# Altium schematic sheet BLHP2432_H24-Fan-Controller.SchDoc
size A4; SheetNumber: 1; SheetTotal: 1
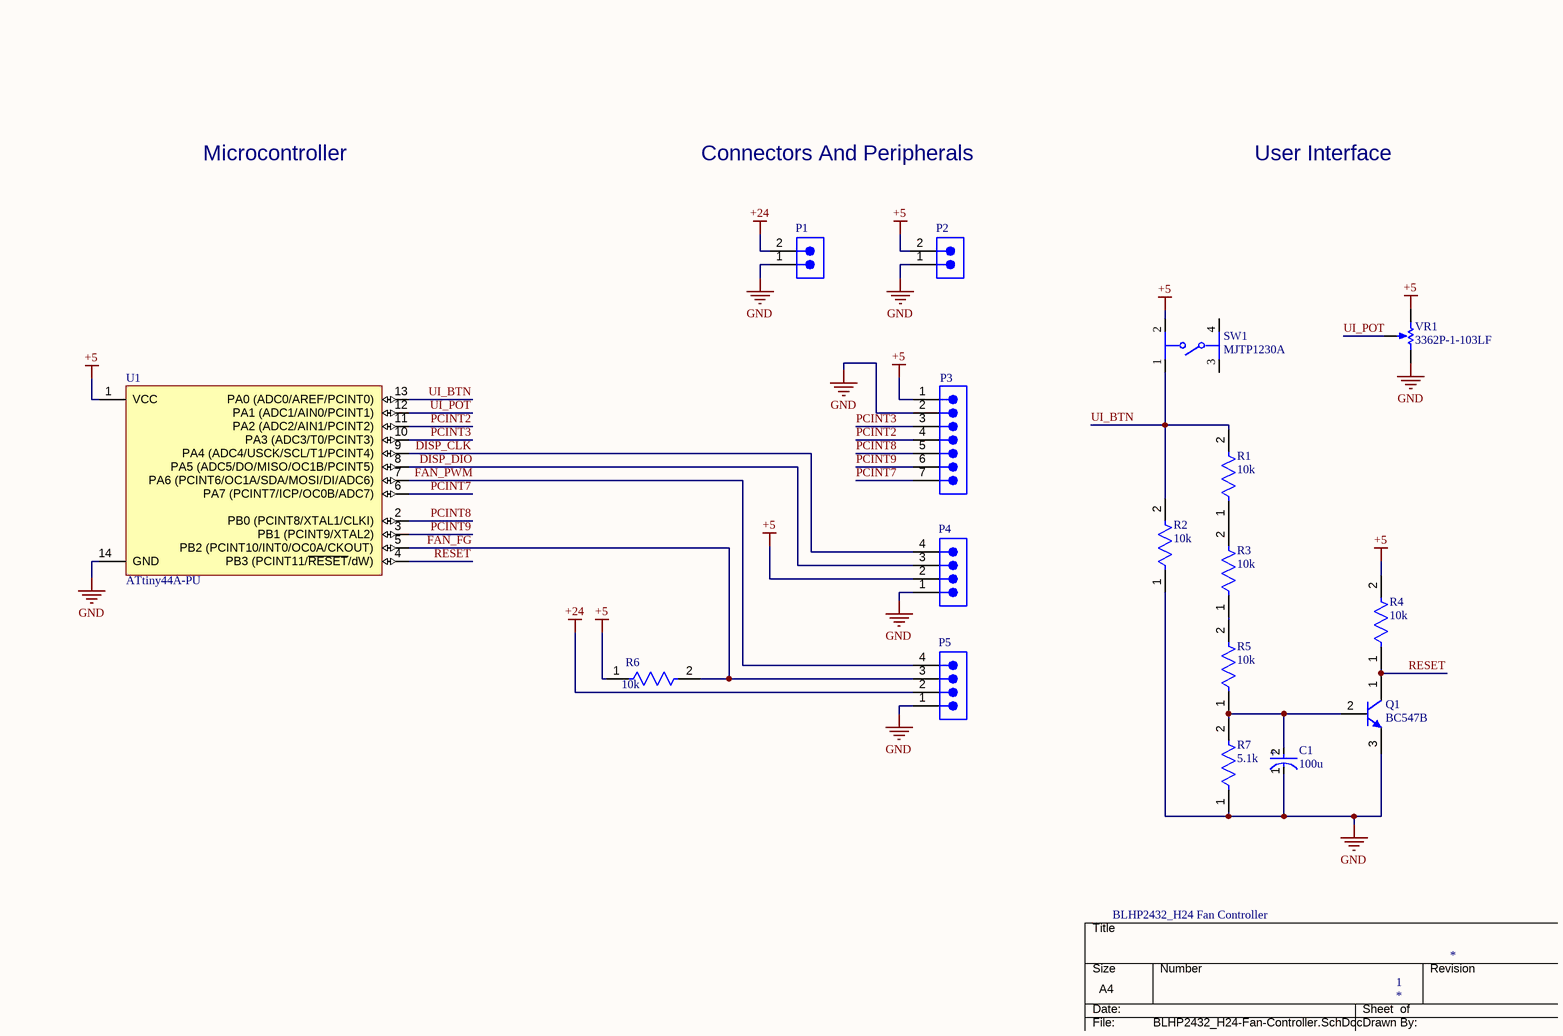
[diagram p0: BLHP2432_H24-Fan-Controller.SchDoc]

## Parts
C1  100u  [FP-UHW1E222MHD-MFG]
P1  TSW-102-26-G-S  [SMTC-TSW-102-26-XX-S]  (value not drawn)
P2  TSW-102-26-G-S  [SMTC-TSW-102-26-XX-S]  (value not drawn)
P3  61300711021  [61300711021]  (value not drawn)
P4  (no value)  [SMTC-TSW-104-08-X-S]
P5  (no value)  [SMTC-TSW-104-08-X-S]
Q1  BC547B  [ONSC-TO-92-3-29-11]
R1  10k  [FP-MBB0207-MFG]
R2  10k  [FP-MBB0207-MFG]
R3  10k  [FP-MBB0207-MFG]
R4  10k  [FP-MBB0207-MFG]
R5  10k  [FP-MBB0207-MFG]
R6  10k  [FP-MBB0207-MFG]
R7  5.1k  [FP-MBB0207-MFG]
SW1  MJTP1230A  [FP-MJTP1230A-MFG]
U1  ATtiny44A-PU  [14P3]
VR1  3362P-1-103LF  [BOUR-3362P]

## Nets
+5: P2.2 P3.1 P4.2 R4.2 R6.1 SW1.2 U1.1(VCC) VR1.1(CCW)
+24: P1.2 P5.2
GND: C1.1(C) P1.1 P2.1 P3.2 P4.1 P5.1 Q1.3(E) R2.1 R7.1 U1.14(GND) VR1.3(CW)
DISP_CLK: P4.4 U1.9(PA4_(ADC4/USCK/SCL/T1/PCINT4))
DISP_DIO: P4.3 U1.8(PA5_(ADC5/DO/MISO/OC1B/PCINT5))
FAN_FG: P5.3 R6.2 U1.5(PB2_(PCINT10/INT0/OC0A/CKOUT))
FAN_PWM: P5.4 U1.7(PA6_(PCINT6/OC1A/SDA/MOSI/DI/ADC6))
PCINT2: P3.4 U1.11(PA2_(ADC2/AIN1/PCINT2))
PCINT3: P3.3 U1.10(PA3_(ADC3/T0/PCINT3))
PCINT7: P3.7 U1.6(PA7_(PCINT7/ICP/OC0B/ADC7))
PCINT8: P3.5 U1.2(PB0_(PCINT8/XTAL1/CLKI))
PCINT9: P3.6 U1.3(PB1_(PCINT9/XTAL2))
RESET: Q1.1(C) R4.1 U1.4(PB3_(PCINT11/~{RESET}/dW))
UI_BTN: R1.2 R2.2 SW1.1 U1.13(PA0_(ADC0/AREF/PCINT0))
UI_POT: U1.12(PA1_(ADC1/AIN0/PCINT1)) VR1.2(S)
NetC1_2: C1.2(A) Q1.2(B) R5.1 R7.2
NetR1_1: R1.1 R3.2
NetR3_1: R3.1 R5.2

Not connected (* = marked no-connect by the designer): SW1 3 4

## Notes on the sheet
- Microcontroller
- Connectors And Peripherals
- User Interface
- BLHP2432_H24 Fan Controller
- DWG. NO.
- REV.
- SHT.
- THIS DOCUMENT AND THE DATA DISCLOSED HEREIN OR HEREWITH IS THE PROPERTY OF ALTIUM LIMITED AND MAY BE FREELY DISTRIBUTED IN WHOLE. NO RIGHTS ARE RESERVED OR EXPRESS OR IMPLIED WARANTEE GIVEN.
- REVISION
- DESCRIPTION
- DATE
- APPROVED
- ENG:
- APPROVALS
- PROJECT
- DSN:
- CHK:
- REFERENCE DOCUMENTS
- PROJECT REVISION:
- TITLE
- DOCUMENT REVISION:
- DESIGN ITEM:
- BOM:
- FAB DWG:
- PCB DWG:
- ASSY DWG:
- SCALE:
- SIZE
- B
- CAGE CODE
- FILE NAME
- DWG NO.
- SHEET
- OF
- REV
- (in symbol CMP-12462-000038-1) +

## Library data of the parts
C1 = CMP-12462-000038-1: CAP ALUM 2200UF 20% 25V RADIAL; Capacitance: 2.2mF; Ripple Current: 3.2A; Impedance: 15mR; Life (Hours): 10000Hour; Tolerance: 20%; Packaging: Bulk; Case/Package: Radial; Min Operating Temperature: -40°C; Height - Seated (Max): 1.063inch; Max Operating Temperature: 105°C; Series: HW; Lead Pitch: 0.197inch; RoHS Compliant: Yes; Voltage Rating: 25V; Package Quantity: 100; Mount: Through Hole
P1 P2 = CMP-1024-00327-1: 0.025" SQ Post Header, Through-hole, Vertical, -55 to 125 degC, 2.54 mm Pitch, 2-Pin, Male, RoHS; Manufacturer: Samtec; Pitch: 2.54 mm; Orientation: Vertical; ComponentLink3Description: Package Specification; PackageReference: TSW-102-26-XX-S; Mounting Technology: Through-hole; ComponentLink2Description: Datasheet; ComponentLink1URL: http://www.samtec.com; DatasheetVersion: F-214; ComponentLink1Description: Manufacturer URL; RoHS: True; ComponentLink2URL: http://www.samtec.com/documents/webfiles/pdf/TSW_TH.PDF; PartNumber: TSW-102-26-G-S; ComponentLink3URL: http://www.samtec.com/documents/webfiles/cpdf/TSW-XXX-XX-XXX-X-XX-XXX-MKT.pdf; PackageDescription: .025[0.64] SQ. Post Terminal Strip Assembly; PackageVersion: DM, 8/1988; Temperature Range: -55 to 125 degC
P3 = CMP-1502-01073-5: THT Angled Pin Header WR-PHD, Pitch 2.54 mm, Single Row, 7 pins; Voltage Rating: 250V; Number of Positions: 7; Contact Resistance: 20mΩ; Connector Type: Male Pin; Gender: Male; Current Rating: 3A; Pitch: 2.54mm; Contact Mating Length: 5.9944mm; Packaging: Bulk; Termination: Solder; Lead Pitch: 2.54mm; Mount: Through Hole; Operating Supply Voltage: 250V; Min Operating Temperature: -40°C; Contact Material: Gold; Number of Rows: 1; RoHS: Compliant; Contact Plating: Gold; Color: Black; Max Operating Temperature: 105°C; Number of Pins: 7; Height: 2.69mm; Number of Contacts: 7
P4 P5 = CMP-1024-00357-1: 0.025" SQ Post Header, Through-hole, Vertical, -55 to 125 degC, 2.54 mm Pitch, 4-Pin, Male, RoHS; Manufacturer: Samtec; PartNumber: TSW-104-08-G-S; Pitch: 2.54 mm; RoHS: True; ComponentLink3URL: http://www.samtec.com/documents/webfiles/cpdf/TSW-XXX-XX-XXX-X-XX-XXX-MKT.pdf; Mounting Technology: Through-hole; ComponentLink2URL: http://www.samtec.com/documents/webfiles/pdf/TSW_TH.PDF; ComponentLink1URL: http://www.samtec.com; ComponentLink3Description: Package Specification; PackageVersion: DM, 8/1988; ComponentLink2Description: Datasheet; PackageReference: TSW-104-08-X-S; PackageDescription: .025[0.64] SQ. Post Terminal Strip Assembly; ComponentLink1Description: Manufacturer URL; Temperature Range: -55 to 125 degC; DatasheetVersion: F-214; Orientation: Vertical
Q1 = CMP-1048-01467-1: Amplifier Transistor, NPN Silicon, 3-Pin TO-92, Bulk Box; Manufacturer: On Semiconductor; IC Continuous (A): 0.1; fT Min (MHz): 150; DatasheetVersion: Rev. 7; ComponentLink1URL: http://www.onsemi.com/; Polarity: NPN; RoHS: FALSE; ComponentLink1Description: Manufacturer URL; Packing: Bulk Box; PackageDescription: 3-Pin Transistor Outline, Body 4.825 x 3.685 mm, Pitch 1.27 mm; ComponentLink3URL: http://www.onsemi.cn/pub_link/Collateral/2N6426-D.PDF; ComponentLink2Description: Datasheet; PackageVersion: Rev. AM; PackageReference: TO-92-3-29-11_AM_SL; ComponentLink3Description: Package Specification; Mounting Technology: Through Hole; PartNumber: BC547B; ComponentLink2URL: http://www.onsemi.com/pub_link/Collateral/BC546-D.PDF
R1-R7 = CMP-02408-000035-1: RES 10K OHM 0.6W 1% AXIAL; Voltage Rating: 300V; Resistance: 10kR; Max Power Dissipation: 600mW; Temperature Coefficient: 50ppm/°C; Radiation Hardening: No; Case/Package: Conformal; Termination: Axial; Military Standard: Not; Length: 6.5mm; Voltage Rating (DC): 300V; RoHS Compliant: Yes; Number of Terminations: 2; Packaging: Tape and Reel; Features: Automotive AEC-Q200; Tolerance: 1%; Min Operating Temperature: -55°C; Power Rating: 600mW; Lead Free: Lead Free; Resistor Type: Metal Film; Construction: Cylindrical; Series: MBB 0207 - Professional; Max Operating Temperature: 155°C; Diameter: 2.5mm; Resistance Tolerance: 1%; Contact Plating: Tin; Technology: THIN FILM
SW1 = CMP-47024-000004-1: SWITCH TACTILE SPST-NO 0.05A 12V; Mechanical Life: 100000Cycles; Throw Configuration: SPST; Actuator Length: 1.4mm; Switch Travel: 0.25mm; Actuator Color: Black; Operating Force: 160gf; Contact Resistance: 100mR; Actuator Type: Standard; Switch Function: Off-Mom; Actuator Material: Thermoplastic; Illumination Type: Non-Illuminated; Current Rating: 50mA; Min Operating Temperature: -20°C; Series: MJTP; Electrical Life: 100000Cycles; Mount: Through Hole; Packaging: Bulk; Color: Black; Package Quantity: 2000; Voltage Rating (DC): 12V; REACH SVHC: No SVHC; Orientation: Straight; Termination: PC Pin; Contact Material: Bronze; RoHS Compliant: Yes; Max Voltage Rating (DC): 12V; Max Operating Temperature: 70°C; Contact Plating: Silver
U1 = CMP-0093-00042-2: 8-bit AVR Microcontroller,  20MHz, 1.8-5.5V, 4KB Flash, 256 Bytes EEPROM, 256 Bytes SRAM, 14-pin PDIP, Industrial Grade (-40°C to 85°C), Pb-Free; PackageVersion: revB, Oct-2010; ComponentLink3URL: http://www.atmel.com/dyn/resources/prod_documents/8183S.pdf; ComponentLink2Description: ATtiny24A/44A/84A Datasheet; ComponentLink2URL: http://www.atmel.com/dyn/resources/prod_documents/doc8183.pdf; ComponentLink3Description: ATtiny24A/44A/84A Summary; RevisionNote: DatasheetVersion updated. URLs added.; Code_JEDEC: MS-001-AA; DatasheetVersion: revD, Apr-2011; ComponentLink1URL: http://www.atmel.com/; PackageDescription: 14-Lead Plastic Dual In-Line, 300 mil/7.62 mm Wide Body (PDIP); ComponentLink1Description: Manufacturer URL; PackageReference: 14P3
VR1 = CMP-1747-00004-1: Square Trimpot(R) Trimming Potentiometer, 10 KOhm, 300 V, -55 to 125 degC, 3-Pin THD, RoHS, Tube; Voltage Rating: 220 mV; Power Rating: 1 W; Tolerance: 1%; Resistance: 50 mohm; Case/Package: 1206; Length: 3.2 mm; RoHSCompliant: True; PackageDescription: 3-Pin Through Hole Device, Body 6.6 x 6.99 mm, Pitch 2.54 mm; ComponentLink2Description: Datasheet; REACH SVHC: No SVHC; Mount: Surface Mount; Height: 0.6 mm; Packaging: Tape and Reel; ComponentLink1URL: http://www.bourns.com/; Case Code (Imperial): 0612; Pins: 2; Case Code (Metric): 1632; ComponentLink2URL: http://www.bourns.com/docs/Product-Datasheets/3362.pdf; Min Operating Temperature: -25degC; ComponentLink1Description: Manufacturer URL; PackageReference: 3326P; Max Operating Temperature: 125degC; Width: 1.6 mm; Package Quantity: 5000; DatasheetVersion: May-16